# EAGLE design eeZeeProp (EAGLE 6.4)
DATABASE: ./../../../eagle/PARTSDB.txt
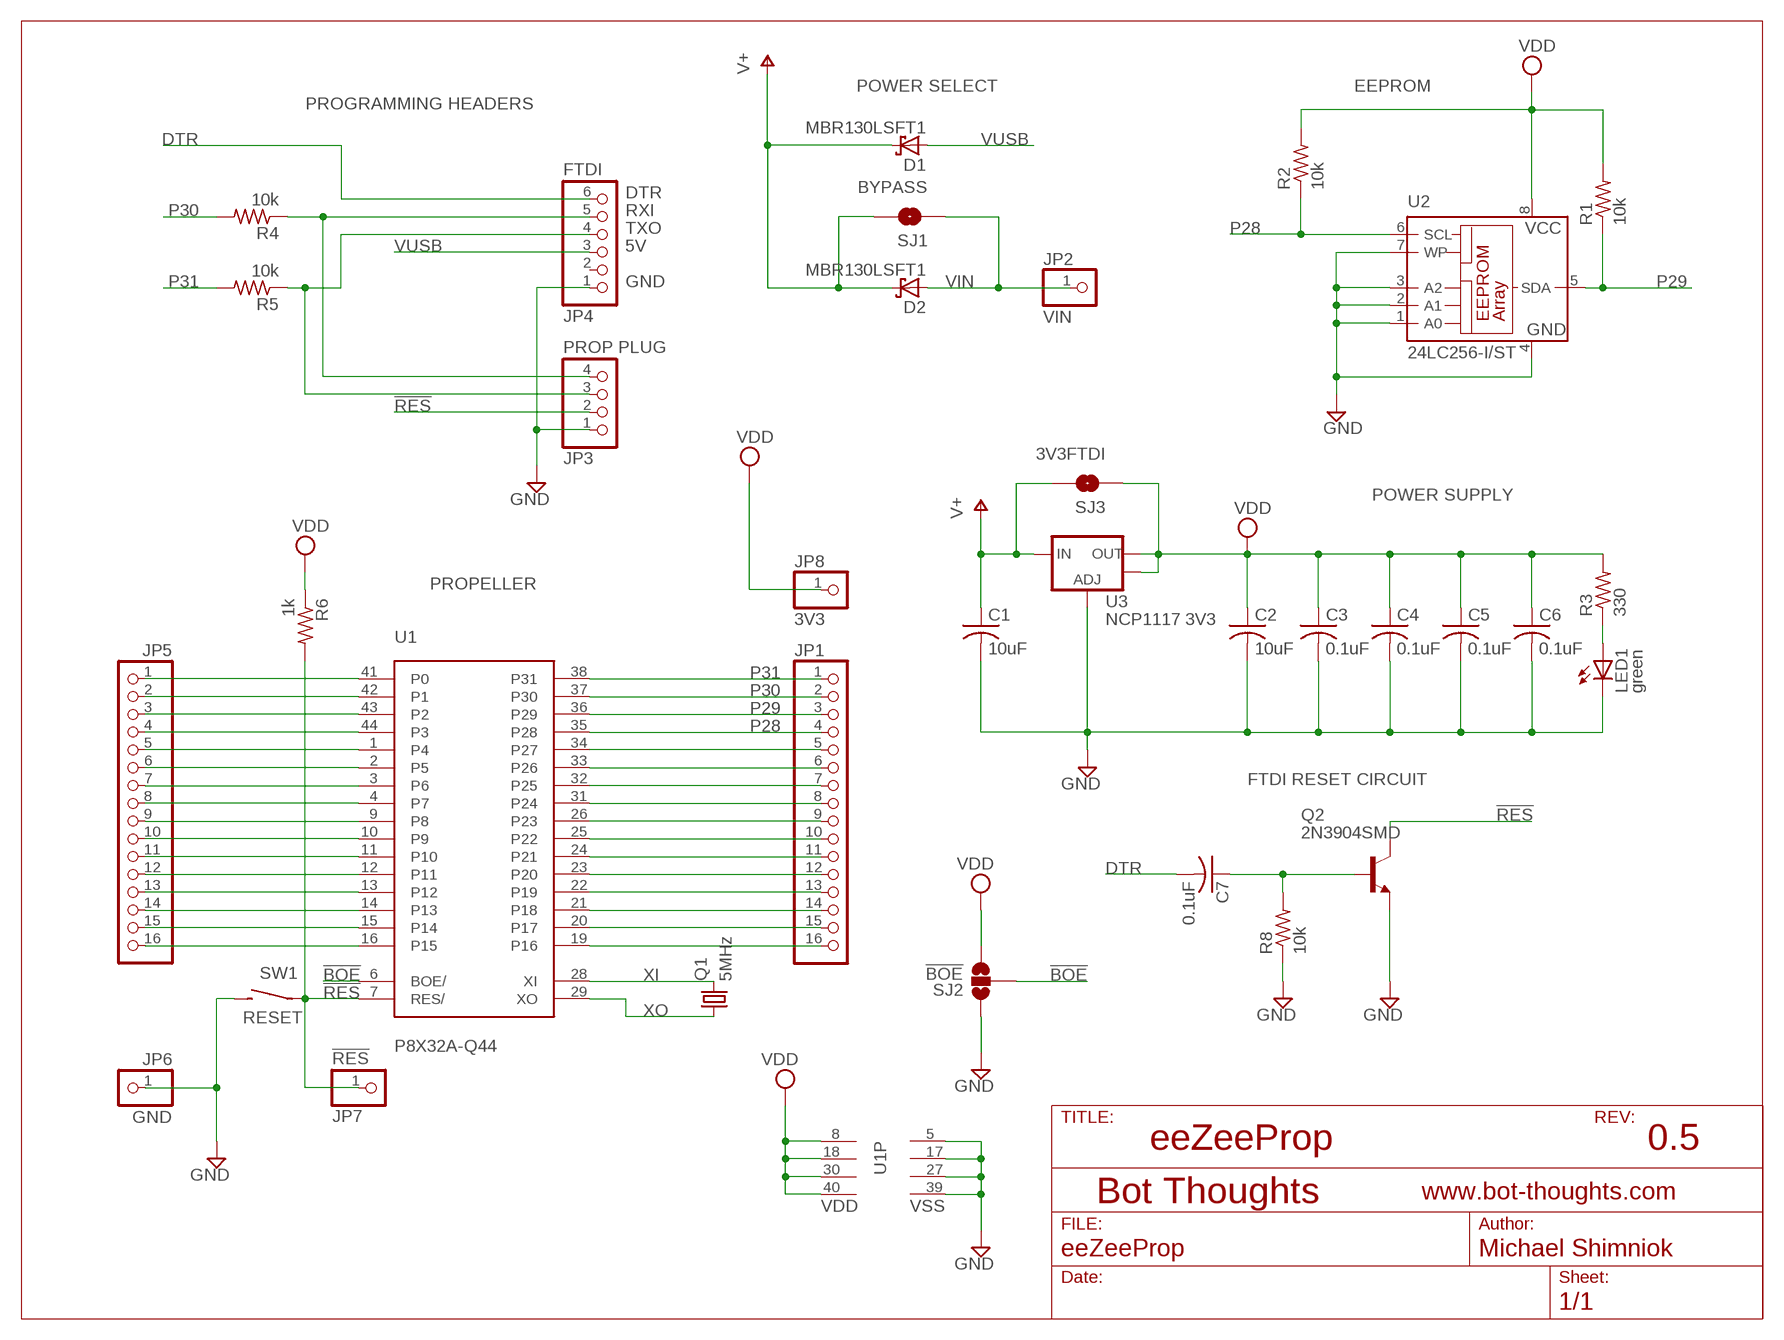
[diagram p0: schematic, sheet 1]

## Parts
C1  10uF  C-USC1206  [C1206]
C2  10uF  C-USC1206  [C1206]
C3  0.1uF  C-USC0603  [C0603]
C4  0.1uF  C-USC0603  [C0603]
C5  0.1uF  C-USC0603  [C0603]
C6  0.1uF  C-USC0603  [C0603]
C7  0.1uF  C-USC0603  [C0603]
D1  MBR130LSFT1  SCHOTTKY-DIODE-MBR130LSFT1  [SOD123FL]
D2  MBR130LSFT1  SCHOTTKY-DIODE-MBR130LSFT1  [SOD123FL]
JP1  PINHD-1X16_2.54-S  [1X16-S]
JP2  VIN  PINHD-1X01_2.54  [1X01]
JP3  PROP PLUG  PINHD-1X04_2.54-S  [1X04-S]
JP4  FTDI  PINHD-1X06_2.54-S  [1X06-S]
JP5  PINHD-1X16_2.54-S  [1X16-S]
JP6  GND  PINHD-1X01_2.54  [1X01]
JP7  !RES  PINHD-1X01_2.54  [1X01]
JP8  3V3  PINHD-1X01_2.54  [1X01]
LED1  green  LEDCHIPLED_1206  [CHIPLED_1206]
Q1  5MHz  CRYSTALHC49U-V  [HC49U-V]
Q2  2N3904SMD  [SOT-23]
R1  10k  R-US_R0603  [R0603]
R2  10k  R-US_R0603  [R0603]
R3  330  R-US_R0603  [R0603]
R4  10k  R-US_R0603  [R0603]
R5  10k  R-US_R0603  [R0603]
R6  1k  R-US_R0603  [R0603]
R8  10k  R-US_R0603  [R0603]
SJ1  BYPASS  SOLDERJUMPERNO  [SJ_2S-NO]
SJ2  !BOE  SOLDERJUMPER_2WAYS  [SJ_3]
SJ3  3V3FTDI  SOLDERJUMPERNO  [SJ_2S-NO]
SW1  RESET  SPST_TAC_RECT1  [6MMTACTILE_RECT]
U1  P8X32A-Q44  [P8X32A-Q44]
U2  24LC256-I/ST  24LC128SN  [SO-08]
U3  NCP1117 3V3  V_REG_LM1117SOT223  [SOT223]

## Nets
!BOE: SJ2.2 U1.6(BOE/)
!RES: JP3.2 JP7.1 Q2.1(C) R6.2 SW1.P$1(P) U1.7(RES/)
DTR: C7.2 JP4.6
GND: C1.2 C2.2 C3.2 C4.2 C5.2 C6.2 JP3.1 JP4.1 JP6.1 LED1.C Q2.2(E) R8.1 SJ2.1 SW1.P$2(S) U1.5(VSS) U1.17(VSS) U1.27(VSS) U1.39(VSS) U2.1(A0) U2.2(A1) U2.3(A2) U2.4(GND) U2.7(WP) U3.1(ADJ)
N$1: JP5.1 U1.41(P0)
N$2: JP5.2 U1.42(P1)
N$3: JP5.3 U1.43(P2)
N$4: JP5.4 U1.44(P3)
N$5: LED1.A R3.1
N$6: JP5.5 U1.1(P4)
N$8: JP5.6 U1.2(P5)
N$9: JP5.7 U1.3(P6)
N$10: JP5.8 U1.4(P7)
N$11: JP5.9 U1.9(P8)
N$12: JP5.10 U1.10(P9)
N$13: JP5.11 U1.11(P10)
N$14: JP5.12 U1.12(P11)
N$15: JP5.13 U1.13(P12)
N$16: JP5.14 U1.14(P13)
N$17: JP5.15 U1.15(P14)
N$18: JP5.16 U1.16(P15)
N$19: JP1.5 U1.34(P27)
N$20: JP1.6 U1.33(P26)
N$21: JP1.7 U1.32(P25)
N$22: JP1.8 U1.31(P24)
N$23: JP1.9 U1.26(P23)
N$24: JP1.10 U1.25(P22)
N$25: JP1.11 U1.24(P21)
N$26: JP1.12 U1.23(P20)
N$27: JP1.13 U1.22(P19)
N$28: JP1.14 U1.21(P18)
N$29: JP1.15 U1.20(P17)
N$30: JP1.16 U1.19(P16)
N$31: C7.1 Q2.3(B) R8.2
P28: JP1.4 R2.1 U1.35(P28) U2.6(SCL)
P29: JP1.3 R1.1 U1.36(P29) U2.5(SDA)
P30: JP1.2 R4.2 U1.37(P30)
P31: JP1.1 R5.2 U1.38(P31)
RXI: JP3.4 JP4.5 R4.1
TXO: JP3.3 JP4.4 R5.1
V+: C1.1 D1.C D2.C SJ1.2 SJ3.2 U3.3(IN)
VDD: C2.1 C3.1 C4.1 C5.1 C6.1 JP8.1 R1.2 R2.2 R3.2 R6.1 SJ2.3 SJ3.1 U1.8(VDD) U1.18(VDD) U1.30(VDD) U1.40(VDD) U2.8(VCC) U3.2(OUT) U3.4(OUT)
VIN: D2.A JP2.1 SJ1.1
VUSB: D1.A JP4.3
XI: Q1.2 U1.28(XI)
XO: Q1.1 U1.29(XO)
Unconnected: JP4.2

## Notes on the sheet
- POWER SELECT | EEPROM
- PROGRAMMING HEADERS
- DTR
- RXI
- TXO
- 5V
- GND
- POWER SUPPLY
- PROPELLER
- FTDI RESET CIRCUIT
- !BOE
- eeZeeProp | 0.5

## Library data of the parts
C1 C2 = rcl:C-US: CAPACITOR, American symbol; PARTNO: T491A106M006AT; SIZE: (0603); TC: X5R; TOL: 20%; TYPE: CER; VOLT: 10V
C3-C6 = rcl:C-US: CAPACITOR, American symbol; PARTNO: 0603YC104KAT2A; SIZE: (0603); TC: X5R; TOL: 20%; TYPE: CER; VOLT: 10V
C7 = rcl:C-US: CAPACITOR, American symbol; PARTNO: 0603YC104KAT2A
D1 D2 = bt_diode:SCHOTTKY-DIODE: Schottky Diode; PARTNO: MBR130LSFT1G
JP1 JP5 = pinhead-2:PINHD-1X16: PIN HEADER
JP2 JP6-JP8 = pinhead-2:PINHD-1X01: PIN HEADER
JP3 = pinhead-2:PINHD-1X04: PIN HEADER
JP4 = pinhead-2:PINHD-1X06: PIN HEADER; PARTNO: 2211S-06G
LED1 = led:LED: LED OSRAM: - CHIPLED LG R971, LG N971, LY N971, LG Q971, LY Q971, LO R971, LY R971 LH N974, LH R974 LS Q976, LO Q976, LY Q976 LO Q996 - Hyper CHIPLED LW Q18S LB Q993, LB Q99A, LB R99A - SideLED LS A670, LO A670, LY A670, LG A670, LP A670 LB A673, LV A673, LT A673, LW A673 LH A674 LY A675 LS A676, LA A676, LO A676, LY A676, LW A676 LS A679, LY A679, LG A679 - Hyper Micro SIDELED® LS Y876, LA Y876, LO Y876, LY Y876 LT Y87S - SmartLED LW L88C, LW L88S LB L89C, LB L89S, LG L890 LS L89K, LO L89K, LY L89K LS L896, LA L896, LO L896, LY L896 - TOPLED LS T670, LO T670, LY T670, LG T670, LP T670 LSG T670, LSP T670, LSY T670, LOP T670, LYG T670 LG T671, LOG T671, LSG T671 LB T673, LV T673, LT T673, LW T673 LH T674 LS T676, LA T676, LO T676, LY T676, LB T676, LH T676, LSB T676, LW T676 LB T67C, LV T67C, LT T67C, LS T67K, LO T67K, LY T67K, LW E67C LS E67B, LA E67B, LO E67B, LY E67B, LB E67C, LV E67C, LT E67C LW T67C LS T679, LY T679, LG T679 LS T770, LO T770, LY T770, LG T770, LP T770 LB T773, LV T773, LT T773, LW T773 LH T774 LS E675, LA E675, LY E675, LS T675 LS T776, LA T776, LO T776, LY T776, LB T776 LHGB T686 LT T68C, LB T68C - Hyper Mini TOPLED® LB M676 - Mini TOPLED Santana® LG M470 LS M47K, LO M47K, LY M47K Source: http://www.osram.convergy.de LUXEON: - LUMILED® LXK2-PW12-R00, LXK2-PW12-S00, LXK2-PW14-U00, LXK2-PW14-V00 LXK2-PM12-R00, LXK2-PM12-S00, LXK2-PM14-U00 LXK2-PE12-Q00, LXK2-PE12-R00, LXK2-PE12-S00, LXK2-PE14-T00, LXK2-PE14-U00 LXK2-PB12-K00, LXK2-PB12-L00, LXK2-PB12-M00, LXK2-PB14-N00, LXK2-PB14-P00, LXK2-PB14-Q00 LXK2-PR12-L00, LXK2-PR12-M00, LXK2-PR14-Q00, LXK2-PR14-R00 LXK2-PD12-Q00, LXK2-PD12-R00, LXK2-PD12-S00 LXK2-PH12-R00, LXK2-PH12-S00 LXK2-PL12-P00, LXK2-PL12-Q00, LXK2-PL12-R00 Source: www.luxeon.com KINGBRIGHT: KA-3528ASYC Source: www.kingbright.com; PARTNO: LG N971-KN-1
Q1 = crystal:CRYSTAL: CRYSTAL; OC_FARNELL: 1666969; OC_NEWARK: unknown; PARTNO: HC49US-5.000MABJ-UB
Q2 = bt_transistor:2N3904: NPN Transistor Small signal NPN Bipolar Junction Transistor (BJT). Use this device to represent any of a number of such transistors with similar package and pinout: 2N4401, 2N3904, 2N2222, etc.; PARTNO: MMBT3904LT3G
R1 R2 R8 = rcl:R-US_: RESISTOR, American symbol; PARTNO: ERJ-3GEYJ103V; RATE: 100mW; SIZE: (0603); TOL: 5%
R3 = rcl:R-US_: RESISTOR, American symbol; PARTNO: ERJ-3GEYJ331V
R4-R6 = rcl:R-US_: RESISTOR, American symbol; PARTNO: RC0603JR-071KL; RATE: 100mW; SIZE: (0603); TOL: 5%
SJ1 SJ3 = SparkFun:SOLDERJUMPER: Solder Jumper Standard SMD solder jumper. Used to automate production. Two varients : Normally Open and Normally Closed are the same, but have different paste layers. NC will have a large amount of paste and should jumper during reflow.
SJ2 = SparkFun:SOLDERJUMPER_2WAY: Solder Jumper 2 way solder jumper
SW1 = mes_electromech:SPST: SPST SWITCH; PARTNO: MJTP1243
U1 = parallax_propeller:P8X32A-Q44; PARTNO: P8X32A-Q44
U2 = microchip:24*: Serial EEPROM I2C; MF: OnSemi; MPN: CAT24C256WI-GT3; OC_FARNELL: 9757937; OC_NEWARK: 30H1511; PARTNO: CAT24C256WI-GT3
U3 = SparkFun:V_REG_LM1117: Voltage Regulator LM1117 Standard adjustable voltage regulator but in SMD form. Spark Fun Electronics SKU : COM-00595; PARTNO: NCP1117ST33T3G

## Board
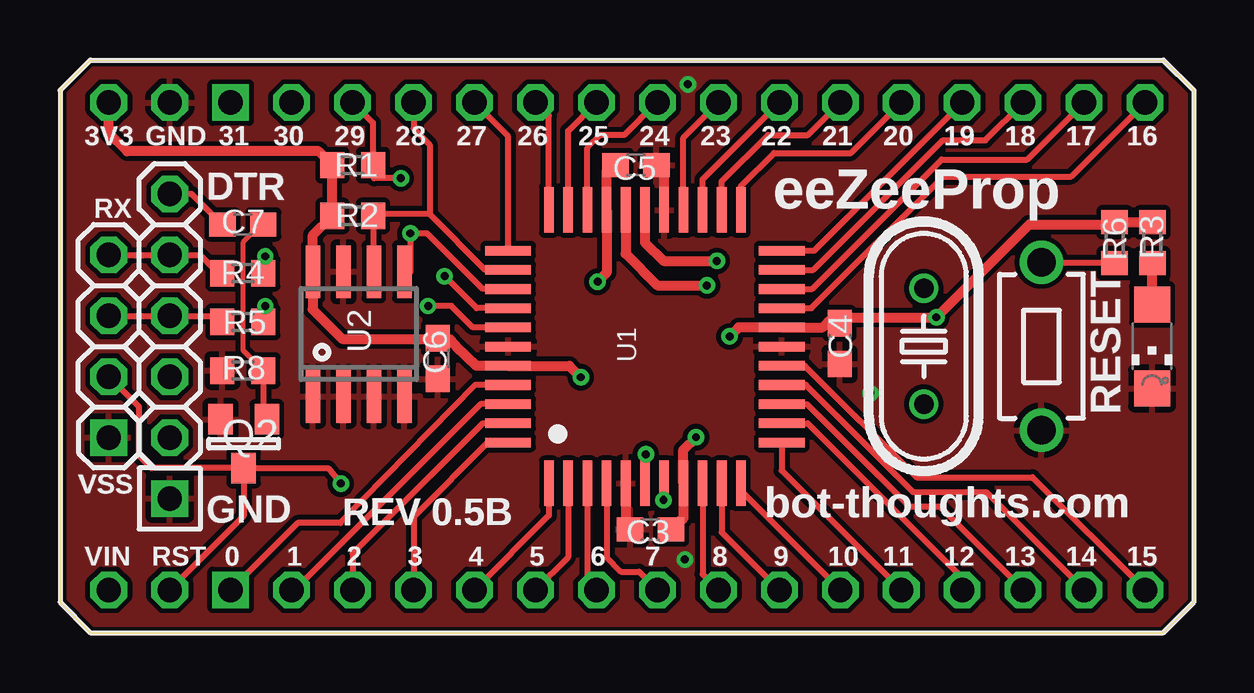
[diagram p1: board, top side]
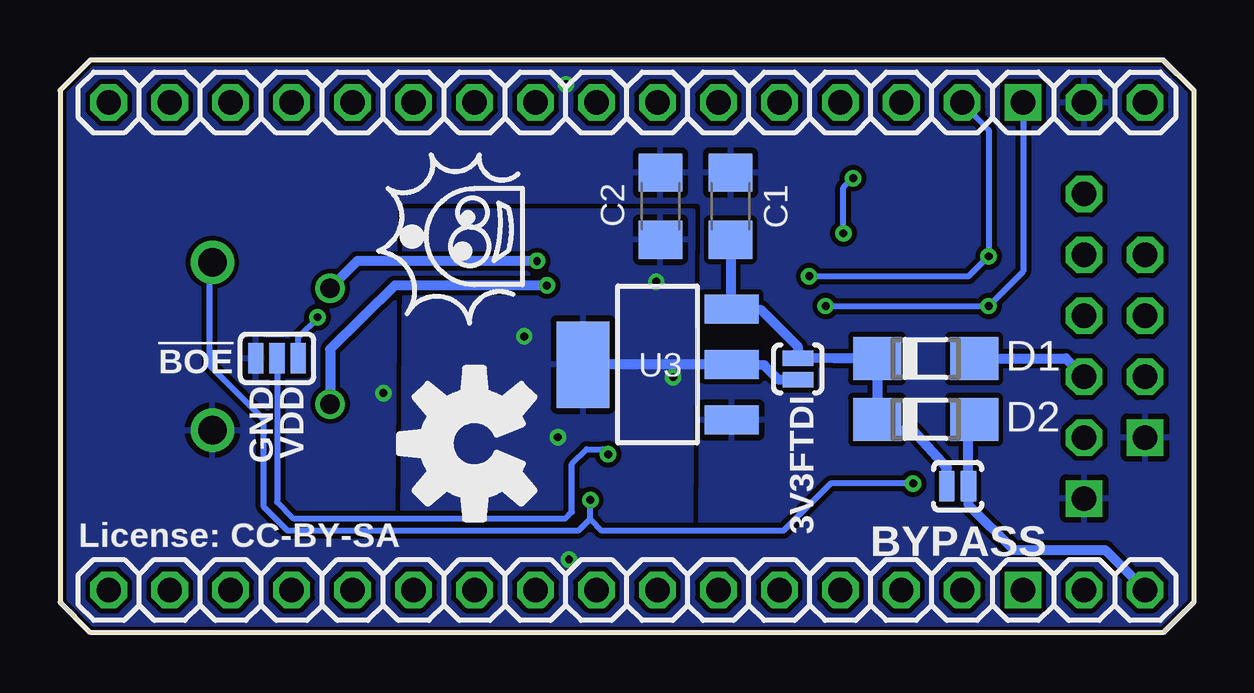
[diagram p2: board, bottom side, seen from below]

Size 47.24 x 23.88 mm. Coordinates in mm from the lower left corner, seen from the top.
Outline: 1.27,0 45.97,0 47.24,1.27 47.24,22.61 45.97,23.88 1.27,23.88 0,22.61 0,1.27 1.27,0
Copper layers (1*16): Top 0.0356mm / dielectric 1.5011mm / Bottom 0.0356mm
Design rules "LaenPCBOrder *": minimum track width 6mil, minimum drill 13mil, track to track 8mil, track to pad 8mil, pad to pad 8mil, via to via 8mil, smd to smd 8mil, copper to edge 10mil, drill to drill 10mil, minimum pad ring 7mil, minimum via ring 7mil, stop-mask expansion 3mil, vias tented up to drill 20mil, thermal gap 10mil

### Footprints (pad centres in the part's own frame; a part is rotated, then mirrored left to right if it is on the bottom)
C1206 = smd 1.6 x 1.8: 1 -1.4,0; 2 1.4,0
C0603 = smd 1.1 x 1: 1 -0.85,0; 2 0.85,0
SOD123FL = smd 2 x 1.8: A 2.025,0; C -2.025,0
1X16-S = drill 1.016 square: 1 -19.05,0 | drill 1.016 octagon: 2 -16.51,0; 3 -13.97,0; 4 -11.43,0; 5 -8.89,0; 6 -6.35,0; 7 -3.81,0; 8 -1.27,0; 9 1.27,0; 10 3.81,0; 11 6.35,0; 12 8.89,0; 13 11.43,0; 14 13.97,0; 15 16.51,0; 16 19.05,0
1X01 = drill 1.016 octagon: 1 0,0
1X04-S = drill 1.016 square: 1 -3.81,0 | drill 1.016 octagon: 2 -1.27,0; 3 1.27,0; 4 3.81,0
1X06-S = drill 1.016 square: 1 -6.35,0 | drill 1.016 octagon: 2 -3.81,0; 3 -1.27,0; 4 1.27,0; 5 3.81,0; 6 6.35,0
CHIPLED_1206 = smd 1.5 x 1.5: A 0,-1.75; C 0,1.75
HC49U-V = drill 0.813: 1 -2.413,0; 2 2.413,0
SOT-23 = smd 1.016 x 1.27: 1 0.025,-1.016; 2 -0.94,1.016; 3 0.991,1.016
R0603 = smd 1 x 1.1: 1 -0.85,0; 2 0.85,0
SJ_2S-NO = smd 0.635 x 1.27: 1 -0.45,0; 2 0.45,0
SJ_3 = smd 0.635 x 1.27: 1 -0.889,0; 2 0,0; 3 0.889,0
6MMTACTILE_RECT = drill 1.2: P$1 -3.5,0; P$2 3.5,0
P8X32A-Q44 = smd 1.9 x 0.4: 1 -5.713,4.013; 2 -5.713,3.212; 3 -5.713,2.413; 4 -5.713,1.613; 5 -5.713,0.812; 6 -5.713,0.013; 7 -5.713,-0.787; 8 -5.713,-1.587; 9 -5.713,-2.388; 10 -5.713,-3.188; 11 -5.713,-3.987; 23 5.688,-3.987; 24 5.688,-3.188; 25 5.688,-2.388; 26 5.688,-1.587; 27 5.688,-0.787; 28 5.688,0.013; 29 5.688,0.812; 30 5.688,1.613; 31 5.688,2.413; 32 5.688,3.212; 33 5.688,4.013 | smd 0.4 x 1.9: 12 -4.013,-5.688; 13 -3.212,-5.688; 14 -2.413,-5.688; 15 -1.613,-5.688; 16 -0.812,-5.688; 17 -0.013,-5.688; 18 0.787,-5.688; 19 1.587,-5.688; 20 2.388,-5.688; 21 3.188,-5.688; 22 3.987,-5.688; 34 3.987,5.713; 35 3.188,5.713; 36 2.388,5.713; 37 1.587,5.713; 38 0.787,5.713; 39 -0.013,5.713; 40 -0.812,5.713; 41 -1.613,5.713; 42 -2.413,5.713; 43 -3.212,5.713; 44 -4.013,5.713
SO-08 = smd 0.6 x 2.2: 1 -1.905,-2.6; 2 -0.635,-2.6; 3 0.635,-2.6; 4 1.905,-2.6; 5 1.905,2.6; 6 0.635,2.6; 7 -0.635,2.6; 8 -1.905,2.6
SOT223 = smd 1.219 x 2.235: 1 -2.311,-3.099; 2 0,-3.099; 3 2.311,-3.099 | smd 3.6 x 2.2: 4 0,3.099

### Placement (x,y rotation side)
C1  19.3,17.78 90 bottom
C2  22.23,17.78 90 bottom
C3  24.6,4.3 180 top
C4  32.49,12.05 270 top
C5  24,19.5 0 top
C6  15.75,11.43 270 top
C7  7.62,17.02 180 top
D1  11.18,11.43 0 bottom
D2  11.18,8.89 0 bottom
JP1  26.16,22.1 180 bottom
JP2  2.03,1.78 0 bottom
JP3  2.03,11.94 90 top
JP4  4.57,11.94 90 top
JP5  26.16,1.78 180 bottom
JP6  4.57,22.1 0 bottom
JP7  4.57,1.78 0 bottom
JP8  2.03,22.1 0 bottom
LED1  45.5,11.94 180 top
Q1  35.99,11.94 90 top
Q2  2N3904SOT23  [SOT-23]  7.63,7.87 0 top
R1  12.2,19.49 180 top
R2  12.2,17.37 180 top
R3  45.52,16.26 90 top
R4  7.62,14.99 0 top
R5  7.62,12.95 0 top
R6  43.94,16.26 270 top
R8  7.62,10.92 0 top
SJ1  9.84,6.1 180 bottom
SJ2  38.2,11.43 0 bottom
SJ3  16.5,10.99 90 bottom
SW1  40.89,11.94 270 top
U1  24.38,11.94 90 top
U2  12.45,12.45 0 top
U3  22.35,11.18 90 bottom

### Tracks (layer width: path | path; a pad name or v marks a point on that pad's centre or on a via)
!BOE  (via drill 0.33)
  Top 0.254: U1.6 24.37,7.4 v24.41,7.44
  Bottom 0.254: SJ2.2 38.2,5.45 37.5,4.75 26.2,4.75 25.91,5.03 25.91,7.03 25.3,7.65 24.62,7.65 v24.41,7.44
!RES  (via drill 0.33)
  Top 0.254: Q2.1 7.65,4.86 JP7.1 | Q2.1 3.81,6.86 3.3,7.37 3.3,9.4 JP3.2 | Q2.1 11.17,6.86 v11.7,6.21 | v25.15,5.53 25.15,6.25 U1.7 | R6.2 40.89,15.41 SW1.P$1
  Bottom 0.254: v11.7,6.21 15.13,6.21 17.1,4.25 24.67,4.25 25.16,4.74 | 25.16,4.74 v25.15,5.53 | 25.16,4.74 25.65,4.25 37.75,4.25 38.75,5.25 38.75,8.89 41,11.14 41,15.33 SW1.P$1
DTR
  Top 0.254: C7.2 6.76,17.02 5.49,18.29 JP4.6
GND  (via drill 0.33)
  Top 0.254: 25.17,19.42 C5.2
  Top 0.406: U1.5 23.57,4.42 C3.2 | U1.27 25.17,19.28 24.89,19.56
  other vias: 26.16,22.86 26.04,3.05 33.77,9.99
  pour Bottom (isolate 0.203, rank 3): 1.27,23.88 45.97,23.88 47.24,22.61 47.24,1.27 45.97,0 1.27,0 0,1.27 0,22.61
  pour Top (isolate 0.203, rank 5): 1.27,23.88 45.97,23.88 47.24,22.61 47.24,1.27 45.97,0 1.27,0 0,1.27 0,22.61
N$1
  Top 0.254: U1.41 17.31,10.32 11.68,4.57 9.91,4.57 JP5.1
N$2
  Top 0.254: U1.42 17.53,9.53 9.91,1.91 JP5.2
N$3
  Top 0.254: U1.43 17.62,8.73 12.19,3.3 JP5.3
N$4
  Top 0.254: JP5.4 14.73,4.83 17.91,8 U1.44
N$5
  Top 0.406: LED1.A 45.52,13.69 R3.1
N$6
  Top 0.254: U1.1 20.37,4.88 JP5.5
N$8
  Top 0.254: U1.2 21.17,3.14 JP5.6
N$9
  Top 0.254: U1.3 21.97,2.16 JP5.7
N$10
  Top 0.254: U1.4 22.77,3.14 23.37,2.54 24.13,2.54 JP5.8
N$11
  Top 0.254: U1.9 26.77,2.44 JP5.9
N$12
  Top 0.254: U1.10 27.57,4.18 JP5.10
N$13
  Top 0.254: U1.11 28.37,5.92 JP5.11
N$14
  Top 0.254: U1.12 30.07,6.76 JP5.12
N$15
  Top 0.254: U1.13 31.15,8.73 37.59,2.29 JP5.13
N$16
  Top 0.254: U1.14 31.11,9.53 35.38,5.26 36.65,5.26 JP5.14
N$17
  Top 0.254: U1.15 31.08,10.32 35.54,5.86 38.59,5.86 JP5.15
N$18
  Top 0.254: U1.16 31.04,11.13 35.69,6.47 40.52,6.47 JP5.16
N$19
  Top 0.254: U1.34 18.67,20.7 JP1.5
N$20
  Top 0.254: U1.33 20.37,21.54 JP1.6
N$21
  Top 0.254: U1.32 21.17,20.92 JP1.7
N$22
  Top 0.254: U1.31 21.97,20.22 22.5,20.75 23.5,20.75 24.85,22.1 JP1.8
N$23
  Top 0.254: U1.26 25.97,20.64 JP1.9
N$24
  Top 0.254: U1.25 26.77,18.9 JP1.10
N$25
  Top 0.254: U1.24 27.57,18.82 29.5,20.75 31.16,20.75 JP1.11
N$26
  Top 0.254: U1.23 28.37,18.62 29.75,20 32.95,20 JP1.12
N$27
  Top 0.254: U1.22 31.42,15.93 JP1.13
N$28
  Top 0.254: U1.21 31.38,15.13 36.78,20.53 38.56,20.53 JP1.14
N$29
  Top 0.254: U1.20 31.34,14.32 36.74,19.72 40.29,19.72 JP1.15
N$30
  Top 0.254: U1.19 31.3,13.53 36.79,19.01 42.13,19.01 JP1.16
N$31
  Top 0.203: C7.1 8.38,17.02 7.62,16.26 7.62,11.77 R8.2
  Top 0.254: R8.2 8.47,9.23 Q2.3
P28
  Top 0.254: U2.6 13.08,17.16 R2.1 13.05,17.45 15.4,17.45 | U1.35 17.72,15.13 15.4,17.45 | JP1.4 14.73,21.01 15.4,20.35 15.4,17.45
P29  (via drill 0.33)
  Top 0.254: U1.36 17.62,14.32 15.3,16.65 v14.6,16.65 14.6,15.05 U2.5 | v14.2,18.95 13.09,18.95 R1.1 13.04,21.25 JP1.3
  Bottom 0.254: v14.6,16.65 14.6,18.55 v14.2,18.95
P30  (via drill 0.33 pad 0.41)
  Top 0.254: U1.37 17.36,13.53 v16.03,14.86 | v8.55,15.69 R4.2
  Bottom 0.254: v16.03,14.86 9.38,14.86 v8.55,15.69 8.55,20.95 JP1.2
P31  (via drill 0.33 pad 0.41)
  Top 0.203: R5.2 8.72,13.2 v8.55,13.62
  Top 0.254: U1.38 17.2,12.73 16.31,13.62 v15.34,13.62
  Bottom 0.254: v15.34,13.62 v8.55,13.62 7.11,15.06 JP1.1
RXI
  Top 0.254: JP3.4 JP4.5 5.84,15.75 6.35,15.24 R4.1
TXO
  Top 0.254: JP3.3 JP4.4 6.35,13.21 R5.1
V+
  Bottom 0.406: SJ1.2 10.29,6.87 11.7,8.41 13.08,8.41 D2.C D1.C 14.98,11.43 SJ3.2 16.51,11.94 18.02,13.45 18.3,13.45 U3.3 19.3,13.54 C1.1
VDD  (via drill 0.33)
  Top 0.254: 32.54,13.15 C4.1 | 22.77,19.23 23.1,19.55 23.1,19.7 C5.1 | 43.85,17.02 R6.1
  Top 0.406: 45.49,17.02 R3.2 R6.1 | JP8.1 2.03,20.83 2.79,20.07 10.77,20.07 R1.2 R2.2 10.54,16.57 U2.8 10.53,13.48 11.76,12.25 15.65,12.25 C6.1 16.17,12.28 16.51,11.94 17.36,11.13 U1.40 21.22,11.13 v21.7,10.65 | 32.54,13.15 v36.51,13.15 40.39,17.02 43.85,17.02 | C3.1 25.97,4.77 U1.8 25.97,7.62 v26.5,8.15 | C4.1 32.43,12.95 32,12.95 31.78,12.73 U1.18 28.28,12.73 v27.9,12.35 | 22.77,19.23 U1.30 22.77,15 v22.4,14.63
  Bottom 0.254: v36.51,13.15 36.51,13.12 37.31,12.32 SJ2.3
  Bottom 0.406: U3.4 U3.2 17.9,11.15 17.3,10.54 SJ3.1 | C2.1 21.97,16.38 22,16.35 21.9,16.35
  pour Bottom (isolate 0.203): 20.89,17.57 20.99,4.58 32.94,4.58 32.84,17.57
VIN
  Bottom 0.406: JP2.1 3.7,3.45 7.5,3.45 9.39,5.33 SJ1.1 9.39,8.19 9.39,8.44 9.39,8.66 D2.A
VUSB
  Bottom 0.406: D1.A 5.33,11.43 JP4.3
XI  (via drill 0.33)
  Top 0.406: U1.28 24.37,16.27 25.15,15.49 v27.37,15.49
  Bottom 0.406: v27.37,15.49 34.85,15.49 Q1.2
XO  (via drill 0.33)
  Top 0.406: U1.29 23.57,15.8 24.89,14.48 v26.95,14.48
  Bottom 0.406: v26.95,14.48 33.29,14.48 35.97,11.84 35.99,11.81 Q1.1

### Text on the board
tPlace: 3V3 | GND | 31 | 30 | 29 | 28 | 27 | 26 | 25 | 24 | 23 | 22 | 21 | 20 | 19 | 18 | 17 | 16 | DTR | eeZeeProp | RX | VSS | GND | bot-thoughts.com | REV 0.5B | VIN | RST | 0 | 1 | 2 | 3 | 4 | 5 | 6 | 7 | 8 | 9 | 10 | 11 | 12 | 13 | 14 | 15
bValues: VDD | GND | License: CC-BY-SA
_tsilk: 3V3 | GND | 31 | 30 | 29 | 28 | 27 | 26 | 25 | 24 | 23 | 22 | 21 | 20 | 19 | 18 | 17 | 16 | DTR | eeZeeProp | RX | RESET | VSS | GND | bot-thoughts.com | REV 0.5B | VIN | RST | 0 | 1 | 2 | 3 | 4 | 5 | 6 | 7 | 8 | 9 | 10 | 11 | 12 | 13 | 14 | 15
_bsilk: !BOE | 3V3FTDI | VDD | GND | BYPASS | License: CC-BY-SA